# EAGLE board MainECU rev7 (EAGLE 9.2.2), part 1 of 2
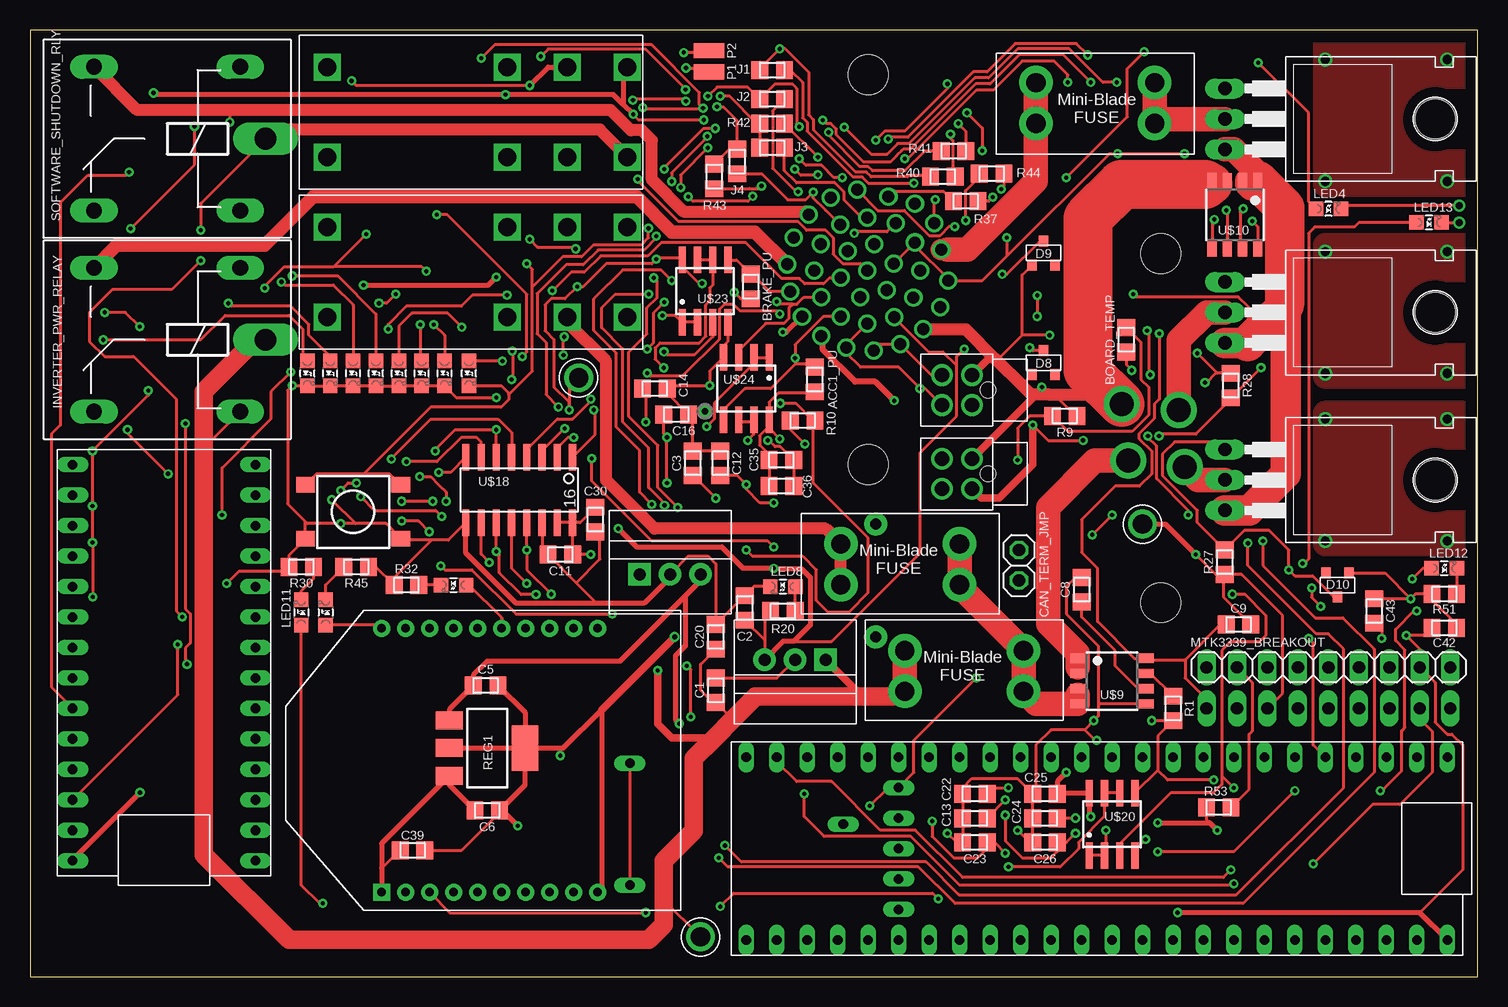
[diagram p2: board, top side]
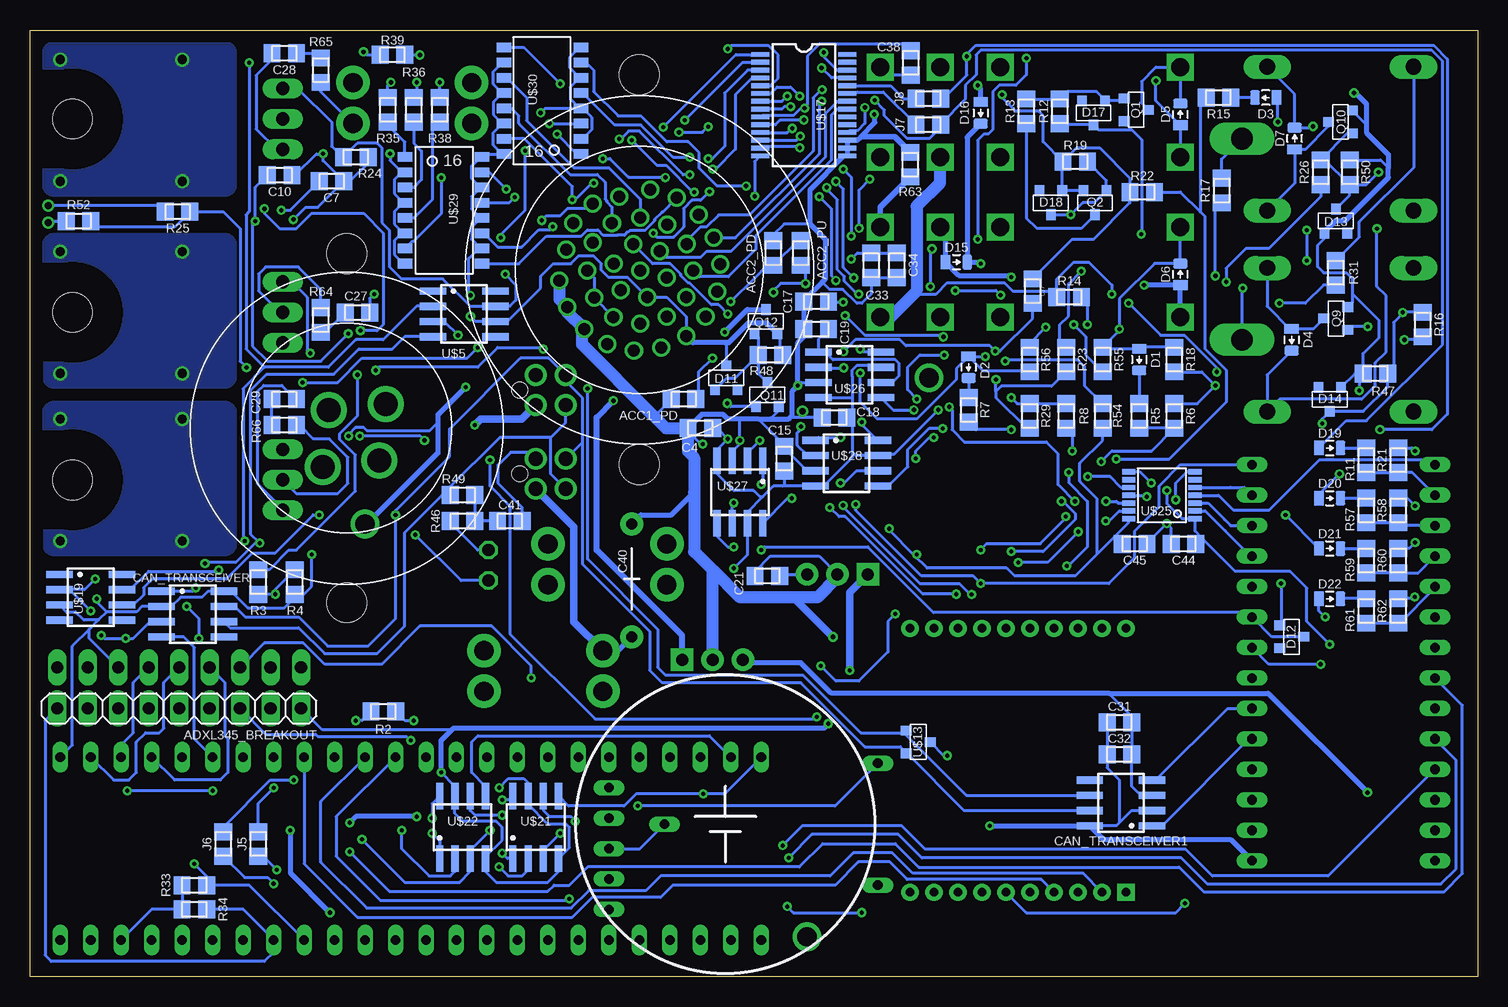
[diagram p3: board, bottom side, seen from below]

Size 120.63 x 78.92 mm. Coordinates in mm from the lower left corner, seen from the top.
Outline: 0,0 120.63,0 120.63,78.92 0,78.92 0,0
Copper layers (1*16): Top 0.035mm / dielectric 1.5mm / Bottom 0.035mm
Design rules "DRC Advanced Circuits": minimum track width 6mil, minimum drill 10mil, track to track 6mil, track to pad 6mil, pad to pad 6mil, via to via 6mil, smd to smd 6mil, copper to edge 40mil, drill to drill 6mil, minimum pad ring 10mil, minimum via ring 8mil, stop-mask expansion 4mil, vias tented up to drill 0mil, thermal gap 10mil

## Footprints (pad centres in the part's own frame; a part is rotated, then mirrored left to right if it is on the bottom)
MINI-BLADE_FUSE_HOLDER = drill 1.613 pad 2.794: L1 0,3.404; L2 0,0; R1 9.906,3.404; R2 9.906,0
0805 = smd 1.4 x 1.5: 1 -1.025,0; 2 1.025,0
1X09 = drill 1.016 long: 1 -8.89,0; 2 -6.35,0; 3 -3.81,0; 4 -1.27,0; 5 1.27,0; 6 3.81,0; 7 6.35,0; 8 8.89,0; 9 11.43,0
RELAY_DPDT = drill 1.5 square: 2 10.008,0; 3 5.004,0; 4 0,0; 5 0,7.493; 6 5.004,7.493; 7 10.008,7.493; COIL+ 25.019,0; COIL- 25.019,7.493
CAP-PTH-LARGE = drill 0.9 pad 1.905: 1 -4.826,0; 2 4.572,0
1X02_SLIM = drill 1.016 octagon: 1 -1.27,0; 2 1.27,0
SOIC-08 = smd 0.6 x 2.2: 1 -1.905,-2.6; 2 -0.635,-2.6; 3 0.635,-2.6; 4 1.905,-2.6; 5 1.905,2.6; 6 0.635,2.6; 7 -0.635,2.6; 8 -1.905,2.6
0805_D = smd 0.8 x 1.2: A -0.9,0; C 0.9,0
SOT23 = smd 0.8 x 0.9: 1 -0.95,-1; 2 0.95,-1; 3 0,1
ZF112 = drill 1.321 long: 1 4.064,14.884; 2 4.064,2.896; O 16.256,14.884; S 16.256,2.896 | drill 1.803 long: P 1.956,8.89
LED-805 = smd 1.2 x 1.2: A 0,-1.05; C 0,1.05
SOLDER_PAD_XSMALL = smd 2.54 x 1.27: P$1 0,0
OKI-78SR = drill 1 pad 1.88 square: 1 -2.54,0 | drill 1 pad 1.88: 2 0,0; 3 2.54,0
SOT223 = smd 1.5 x 2.235: 1 -2.3,-3.15; 2 0,-3.15; 3 2.3,-3.15 | smd 3.8 x 2.2: 4 0,3.15
TACTILE_SWITCH_SMD_6.2MM_TALL = smd 1.55 x 1.3: A1 -3.975,-2.25; A2 3.975,-2.25; B1 -3.975,2.25; B2 3.975,2.25
TEENSY_3.2_SIMPLE = drill 0.8 long: 3.3V 16.51,29.21; A0 16.51,3.81; A1 16.51,6.35; A2 16.51,8.89; A3 16.51,11.43; A4 16.51,13.97; A5 16.51,16.51; A6 16.51,19.05; A7 16.51,21.59; A8 16.51,24.13; A9 16.51,26.67; AGND 16.51,31.75; D0(RX1) 1.27,31.75; D1(TX1) 1.27,29.21; D2 1.27,26.67; D3(CANTX) 1.27,24.13; D4(CANRX) 1.27,21.59; D5 1.27,19.05; D6 1.27,16.51; D7(RX3) 1.27,13.97; D8(TX3) 1.27,11.43; D9(RX2) 1.27,8.89; D10(TX2) 1.27,6.35; D11 1.27,3.81; D12 1.27,1.27; D13 16.51,1.27; GND 1.27,34.29; VIN 16.51,34.29
TEENSY_3.5_EXT = drill 0.8 long: 3.3V 16.51,54.61; 3.3V_1 1.27,24.13; 3.3V_2 6.35,13.97; A0 16.51,29.21; A1 16.51,31.75; A2 16.51,34.29; A3 16.51,36.83; A4 16.51,39.37; A5 16.51,41.91; A6 16.51,44.45; A7 16.51,46.99; A8 16.51,49.53; A9 16.51,52.07; A12 1.27,3.81; A13 1.27,1.27; A14 16.51,1.27; A15 16.51,3.81; A16 16.51,6.35; A17 16.51,8.89; A18 16.51,11.43; A19 16.51,13.97; A20 16.51,16.51; A21 16.51,19.05; A22 16.51,21.59; AGND 16.51,57.15; D0(RX1) 1.27,57.15; D1(TX1) 1.27,54.61; D2 1.27,52.07; D3(CANTX) 1.27,49.53; D4(CANRX) 1.27,46.99; D5 1.27,44.45; D6 1.27,41.91; D7(RX3) 1.27,39.37; D8(TX3) 1.27,36.83; D9(RX2) 1.27,34.29; D10(TX2) 1.27,31.75; D11 1.27,29.21; D12 1.27,26.67; D13 16.51,26.67; D24 1.27,21.59; D25 1.27,19.05; D26 1.27,16.51; D27 1.27,13.97; D28 1.27,11.43; D29 1.27,8.89; D30 1.27,6.35; GND 1.27,59.69; GND_1 16.51,24.13; GND_2 8.89,13.97; PROG 11.43,13.97; RST 13.97,13.97; VBAT 3.81,13.97; VIN 16.51,59.69
XBEE = drill 0.7 pad 1.422 square: 1 -11,5.5 | drill 0.7 pad 1.422: 2 -11,3.5; 3 -11,1.5; 4 -11,-0.5; 5 -11,-2.5; 6 -11,-4.5; 7 -11,-6.5; 8 -11,-8.5; 9 -11,-10.5; 10 -11,-12.5; 11 11,-12.5; 12 11,-10.5; 13 11,-8.5; 14 11,-6.5; 15 11,-4.5; 16 11,-2.5; 17 11,-0.5; 18 11,1.5; 19 11,3.5; 20 11,5.5
TO-220-H-HOLE = drill 1.118 long: 1 -2.54,-6.35; 2 0,-6.35; 3 2.54,-6.35 | hole 3.302: 0,11.176
TEST_POINT = drill 1.6: P$1 0,0
SOP8 = smd 0.76 x 1.27: 1 -1.905,-2.86; 2 -0.635,-2.86; 3 0.635,-2.86; 4 1.905,-2.86; 5 1.905,2.86; 6 0.635,2.86; 7 -0.635,2.86; 8 -1.905,2.86
CR-2450/G1AN = drill 0.8 long: +_0 -5.08,12.7; +_1 5.08,12.7; - 0,-5.08
SSOP28 = smd 0.4 x 1.5: 1 -4.225,-3.625; 2 -3.575,-3.625; 3 -2.925,-3.625; 4 -2.275,-3.625; 5 -1.625,-3.625; 6 -0.975,-3.625; 7 -0.325,-3.625; 8 0.325,-3.625; 9 0.975,-3.625; 10 1.625,-3.625; 11 2.275,-3.625; 12 2.925,-3.625; 13 3.575,-3.625; 14 4.225,-3.625; 15 4.225,3.625; 16 3.575,3.625; 17 2.925,3.625; 18 2.275,3.625; 19 1.625,3.625; 20 0.975,3.625; 21 0.325,3.625; 22 -0.325,3.625; 23 -0.975,3.625; 24 -1.625,3.625; 25 -2.275,3.625; 26 -2.925,3.625; 27 -3.575,3.625; 28 -4.225,3.625
SOIC-16 = smd 0.6 x 2.2: 1 -4.445,-2.794; 2 -3.175,-2.794; 3 -1.905,-2.794; 4 -0.635,-2.794; 5 0.635,-2.794; 6 1.905,-2.794; 7 3.175,-2.794; 8 4.445,-2.794; 9 4.445,2.667; 10 3.175,2.667; 11 1.905,2.667; 12 0.635,2.667; 13 -0.635,2.667; 14 -1.905,2.667; 15 -3.175,2.667; 16 -4.445,2.667
TSSOP-14 = smd 0.45 x 1.1: 1 -1.958,-2.618; 2 -1.308,-2.618; 3 -0.657,-2.618; 4 -0.007,-2.618; 5 0.642,-2.618; 6 1.292,-2.618; 7 1.942,-2.618; 8 1.942,2.918; 9 1.292,2.918; 10 0.642,2.918; 11 -0.007,2.918; 12 -0.657,2.918; 13 -1.308,2.918; 14 -1.958,2.918
11-11F1 = smd 0.8 x 1.2: 1 -4.445,-3.277; 2 -3.175,-3.277; 3 -1.905,-3.277; 4 -0.635,-3.277; 5 0.635,-3.277; 6 1.905,-3.277; 7 3.175,-3.277; 8 4.445,-3.277; 9 4.445,3.15; 10 3.175,3.15; 11 1.905,3.15; 12 0.635,3.15; 13 -0.635,3.15; 14 -1.905,3.15; 15 -3.175,3.15; 16 -4.445,3.15
AUTOSPORT_14-35 = drill 1: P$1 1.143,6.655; P$2 3.124,5.512; P$3 5.359,4.064; P$4 6.452,2.032; P$5 6.756,-0.254; P$6 6.274,-2.489; P$7 5.08,-4.445; P$8 3.302,-5.893; P$9 1.143,-6.655; P$10 -1.143,-6.655; P$11 -3.302,-5.893; P$12 -5.08,-4.445; P$13 -6.274,-2.489; P$14 -6.756,-0.254; P$15 -6.452,2.032; P$16 -5.359,4.064; P$17 -3.124,5.512; P$18 -1.143,6.655; P$19 1.143,4.369; P$20 3.124,3.023; P$21 4.318,1.016; P$22 4.318,-1.27; P$23 3.124,-3.226; P$24 1.143,-4.369; P$25 -1.143,-4.369; P$26 -3.124,-3.226; P$27 -4.318,-1.27; P$28 -4.318,1.016; P$29 -3.124,3.023; P$30 -1.143,4.369; P$31 1.143,1.88; P$32 2.286,-0.102; P$33 1.143,-2.083; P$34 -1.143,-2.083; P$35 -2.286,-0.102; P$36 -1.143,1.88; P$37 0,-0.102 | hole 3.3: -11.491,-11.491; 11.491,11.491
AUTOSPORT_12-04 = drill 2: P$1 0,3.81; P$2 3.708,0.889; P$3 0,-2.108; P$4 -3.708,0.889 | hole 3.3: -10.288,-10.288; 10.288,10.288
NANO-FIT_VERTICAL-4 = drill 1.2: P$1 -1.25,0; P$2 1.25,0; P$3 -1.25,2.5; P$4 1.25,2.5 | hole 1.3: 0,-1.34

## Placement (x,y rotation side)
5ABOARDFUSE  [MINI-BLADE_FUSE_HOLDER]  82.8,27.18 180 top
5AFUSE  [MINI-BLADE_FUSE_HOLDER]  83.82,71.12 0 top
5ASHUTDOWNFUSE  [MINI-BLADE_FUSE_HOLDER]  77.47,36.07 180 top
ACC1_PD  10k  [0805]  66.17,48.13 180 bottom
ACC1_PU  10k  [0805]  65.41,49.78 270 top
ACC2_PD  10k  [0805]  58.67,60.33 90 bottom
ACC2_PU  10k  [0805]  56.39,60.33 270 bottom
ADXL345_BREAKOUT  [1X09]  106.93,22.35 180 bottom
BMS_SHUTDOWN_RLY  RT424012  [RELAY_DPDT]  49.78,75.82 180 top
BOARD_TEMP  THERMISTOR_NCP210805  [0805]  91.36,53.09 90 top
BRAKE_PU  10k  [0805]  60.07,57.53 270 top
C1  10uF  [0805]  57.15,23.88 270 top
C2  10uF  [0805]  59.56,30.73 270 top
C3  47nF  [0805]  55.24,42.8 90 top
C4  .1uF  [0805]  64.77,45.72 180 bottom
C5  1uF  [0805]  37.97,24.26 0 top
C6  1uF  [0805]  38.1,13.84 180 top
C7  47nF  [0805]  95.5,66.29 0 bottom
C8  47nF  [0805]  87.63,32.26 90 top
C9  0.1uF  [0805]  100.71,29.34 0 top
C10  0.1uF  [0805]  99.82,66.8 0 bottom
C11  1uF  [0805]  44.2,35.18 0 top
C12  .1uF  [0805]  57.53,42.8 270 top
C13  470pF  [0805]  78.74,13.21 180 top
C14  47nF  [0805]  52.07,49.02 0 top
C15  .1uF  [0805]  57.78,43.18 90 bottom
C16  .1uF  [0805]  53.85,46.86 180 top
C17  47nF  [0805]  55.12,56.26 180 bottom
C18  .1uF  [0805]  53.59,46.61 180 bottom
C19  .1uF  [0805]  55.12,53.98 0 bottom
C20  10uF  [0805]  57.15,28.32 270 top
C21  10uF  [0805]  59.18,33.4 0 bottom
C22  .1uF  [0805]  78.74,15.24 180 top
C23  .1uF  [0805]  78.74,11.18 0 top
C24  470pF  [0805]  84.58,13.21 180 top
C25  .1uF  [0805]  84.58,15.24 180 top
C26  .1uF  [0805]  84.58,11.18 0 top
C27  [0805]  93.34,55.37 0 bottom
C28  [0805]  99.44,76.96 180 bottom
C29  [0805]  99.44,48.13 0 bottom
C30  0.1uF  [0805]  47.12,38.1 90 top
C31  1uF  [0805]  29.84,21.21 0 bottom
C32  .1uF  [0805]  29.84,18.54 0 bottom
C33  1uF  [0805]  50.55,59.31 90 bottom
C34  .1uF  [0805]  48.39,59.31 90 bottom
C35  1uF  [0805]  62.61,43.05 0 top
C36  .1uF  [0805]  62.61,40.89 0 top
C37  1uF  [0805]  37.08,57.15 270 bottom
C38  0.1uF  [0805]  47.24,76.17 270 bottom
C39  0.1uF  [0805]  31.88,10.54 0 top
C40  470uF  [CAP-PTH-LARGE]  70.48,33.15 90 bottom
C41  4.7nF  [0805]  80.64,37.97 0 bottom
C42  1uF  [0805]  117.86,29.08 180 top
C43  .1uF  [0805]  112.01,30.48 270 top
C44  .1uF  [0805]  24.51,36.07 180 bottom
C45  .1uF  [0805]  28.57,36.07 0 bottom
CAN_TERM_JMP  M02_SLIM  [1X02_SLIM]  82.42,34.29 90 top
CAN_TRANSCEIVER  MCP2551  [SOIC-08]  107.06,30.23 270 bottom
CAN_TRANSCEIVER1  MCP2551  [SOIC-08]  29.72,14.48 90 bottom
D1  TS4148 RYG  [0805_D]  28.19,51.44 270 bottom
D2  TS4148 RYG  [0805_D]  42.42,50.8 270 bottom
D3  TS4148 RYG  [0805_D]  17.65,73.28 180 bottom
D4  TS4148 RYG  [0805_D]  15.49,53.09 270 bottom
D5  TS4148 RYG  [0805_D]  24.77,71.88 90 bottom
D6  TS4148 RYG  [0805_D]  24.77,58.55 90 bottom
D7  TS4148 RYG  [0805_D]  15.24,69.88 90 bottom
D8  MMBZ5246BLT1G  [SOT23]  84.45,51.18 0 top
D9  MMBZ5246BLT1G  [SOT23]  84.45,60.33 0 top
D10  MMBZ5246BLT1G  [SOT23]  108.97,32.64 180 top
D11  MMBZ5246BLT1G  [SOT23]  62.61,49.91 0 bottom
D12  MMBZ5246BLT1G  [SOT23]  15.49,28.32 270 bottom
D13  MMBZ5246BLT1G  [SOT23]  11.81,62.99 0 bottom
D14  MMBZ5246BLT1G  [SOT23]  12.32,48.13 180 bottom
D15  TS4148 RYG  [0805_D]  43.43,59.56 0 bottom
D16  TS4148 RYG  [0805_D]  41.4,72.01 270 bottom
D17  MMBZ5246BLT1G  [SOT23]  32,72.01 180 bottom
D18  MMBZ5246BLT1G  [SOT23]  35.56,64.52 180 bottom
D19  TS4148 RYG  [0805_D]  12.32,44.07 0 bottom
D20  TS4148 RYG  [0805_D]  12.32,39.88 0 bottom
D21  TS4148 RYG  [0805_D]  12.32,35.69 0 bottom
D22  TS4148 RYG  [0805_D]  12.32,31.5 0 bottom
IMD_SHUTDOWN_RLY  RT424009  [RELAY_DPDT]  49.78,62.48 180 top
INVERTER_PWR_RELAY  G5LE  [ZF112]  21.59,61.98 180 top
J1  JUMPER  [0805]  61.85,75.56 180 top
J2  JUMPER  [0805]  61.85,73.15 180 top
J3  JUMPER  [0805]  61.85,69.09 180 top
J4  JUMPER  [0805]  58.93,67.94 90 top
J5  JUMPER  [0805]  101.6,11.05 90 bottom
J6  JUMPER  [0805]  104.52,11.05 90 bottom
J7  JUMPER  [0805]  45.77,71.02 180 bottom
J8  JUMPER  [0805]  45.77,73.2 180 bottom
LED1  White  [LED-805]  36.58,50.29 180 top
LED3  Green  [LED-805]  30.73,50.29 180 top
LED4  Red  [LED-805]  108.2,64.01 270 top
LED5  Yellow  [LED-805]  32.64,50.29 180 top
LED6  Red  [LED-805]  23.11,50.29 180 top
LED7  Green  [LED-805]  28.83,50.29 180 top
LED8  Purple  [LED-805]  62.74,32.51 90 top
LED9  Yellow  [LED-805]  34.54,50.29 180 top
LED10  Red  [LED-805]  35.31,32.64 90 top
LED11  Green  [LED-805]  22.61,30.35 0 top
LED12  Red  [LED-805]  117.86,34.04 270 top
LED13  Red  [LED-805]  116.59,62.87 270 top
LED14  Blue  [LED-805]  24.64,30.35 0 top
LED17  Red  [LED-805]  26.92,50.29 180 top
LED18  Red  [LED-805]  25.02,50.29 180 top
MTK3339_BREAKOUT  [1X09]  106.93,25.78 0 top
P1  SOLDER_PAD  [SOLDER_PAD_XSMALL]  56.57,75.41 0 top
P2  SOLDER_PAD  [SOLDER_PAD_XSMALL]  56.57,77.19 0 top
Q1  P-CHANNEL_MOSFET_DMP3099L-7  [SOT23]  28.45,72.26 270 bottom
Q2  [SOT23]  31.88,64.52 180 bottom
Q9  [SOT23]  11.81,54.86 90 bottom
Q10  [SOT23]  11.43,71.25 90 bottom
Q11  [SOT23]  59.18,48.51 0 bottom
Q12  P-CHANNEL_MOSFET_DMP3099L-7  [SOT23]  59.31,54.61 0 bottom
R1  1K  [0805]  95.25,22.35 270 top
R2  2K  [0805]  91.19,22.1 180 bottom
R3  1K  [0805]  101.6,32.89 270 bottom
R4  2K  [0805]  98.55,32.89 90 bottom
R5  43k  [0805]  28.19,46.74 270 bottom
R6  12k  [0805]  25.27,46.74 90 bottom
R7  43k  [0805]  42.42,47.24 270 bottom
R8  12k  [0805]  34.29,46.74 90 bottom
R9  10k  [0805]  86.23,46.74 180 top
R10  10k  [0805]  64.39,46.35 0 top
R11  43k  [0805]  9.27,43.05 270 bottom
R12  10k  [0805]  34.8,72.14 90 bottom
R13  1k  [0805]  37.59,72.14 90 bottom
R14  2k  [0805]  34.04,56.64 0 bottom
R15  43k  [0805]  21.59,73.28 180 bottom
R16  1.2k  [0805]  4.57,54.36 270 bottom
R17  20k  [0805]  21.34,65.53 270 bottom
R18  2k  [0805]  25.27,51.44 270 bottom
R19  10k  [0805]  33.53,67.94 180 bottom
R20  270  [0805]  62.74,30.48 0 top
R21  12k  [0805]  6.6,43.05 90 bottom
R22  12k  [0805]  27.94,65.41 180 bottom
R23  43k  [0805]  34.29,51.44 270 bottom
R24  10k  [0805]  93.47,68.33 180 bottom
R25  1.2k  [0805]  108.33,63.75 0 bottom
R26  1.2K  [0805]  13.08,67.06 270 bottom
R27  10k  [0805]  99.57,34.54 90 top
R28  10k  [0805]  100.08,49.28 90 top
R29  12k  [0805]  37.34,46.74 90 bottom
R30  33  [0805]  22.61,34.16 0 top
R31  6.8k  [0805]  11.81,58.67 270 bottom
R32  1.2k  [0805]  31.37,32.64 0 top
R33  4.7k  [0805]  106.93,7.62 180 bottom
R34  4.7k  [0805]  106.93,5.59 180 bottom
R35  150  [0805]  90.81,72.26 270 bottom
R36  150  [0805]  88.65,72.26 270 bottom
R37  0  [0805]  77.98,64.64 180 top
R38  150  [0805]  86.49,72.26 270 bottom
R39  150  [0805]  90.42,76.83 180 bottom
R40  150  [0805]  76.07,66.67 0 top
R41  150  [0805]  76.96,68.83 0 top
R42  150  [0805]  61.85,71.12 0 top
R43  150  [0805]  57.02,66.7 270 top
R44  0  [0805]  80.14,66.93 180 top
R45  0  [0805]  27.18,34.16 180 top
R46  60  [0805]  84.58,37.97 180 bottom
R47  10k  [0805]  8.51,50.29 180 bottom
R48  10k  [0805]  58.93,51.82 180 bottom
R49  60  [0805]  84.58,40.13 0 bottom
R50  10k  [0805]  10.67,67.06 90 bottom
R51  1.2k  [0805]  117.86,31.88 180 top
R52  1.2k  [0805]  116.59,62.99 0 bottom
R53  10k  [0805]  99.06,14.1 0 top
R54  5.1k  [0805]  31.24,46.74 90 bottom
R55  2k  [0805]  31.24,51.44 270 bottom
R56  33  [0805]  37.34,51.44 90 bottom
R57  43k  [0805]  9.27,38.86 270 bottom
R58  12k  [0805]  6.6,38.86 90 bottom
R59  43k  [0805]  9.27,34.67 270 bottom
R60  12k  [0805]  6.6,34.67 90 bottom
R61  43k  [0805]  9.27,30.48 270 bottom
R62  12k  [0805]  6.6,30.48 90 bottom
R63  20  [0805]  47.27,67.69 90 bottom
R64  [0805]  96.39,54.74 270 bottom
R65  [0805]  96.39,75.56 90 bottom
R66  [0805]  99.44,45.97 180 bottom
REG  5V  [OKI-78SR]  63.75,26.42 180 top
REG1  LM3940  [SOT223]  38.1,19.05 270 top
REG3  5V  [OKI-78SR]  53.34,33.53 0 top
S1  [TACTILE_SWITCH_SMD_6.2MM_TALL]  26.92,38.73 180 top
SOFTWARE_SHUTDOWN_RLY  G5LE  [ZF112]  21.59,78.74 180 top
U$1  TEENSY_3.2_SIMPLE  [TEENSY_3.2_SIMPLE]  20.07,43.94 180 top
U$2  TEENSY_3.5_EXT  [TEENSY_3.5_EXT]  58.42,19.56 270 top
U$3  XBEE  [XBEE]  34.8,18.03 90 top
U$4  N-CHANNEL_MOSFET_IRF1324PBF  [TO-220-H-HOLE]  105.92,55.37 270 top
U$5  MC34152  [SOIC-08]  84.45,55.24 270 bottom
U$6  N-CHANNEL_MOSFET_IRF1324PBF  [TO-220-H-HOLE]  105.92,41.4 270 top
U$7  N-CHANNEL_MOSFET_IRF1324PBF  [TO-220-H-HOLE]  105.92,71.5 270 top
U$8  TEST_POINT  [TEST_POINT]  55.88,3.3 0 top
U$9  ACS715_CURRENT_SENSOR  [SOP8]  90.17,24.64 270 top
U$10  ACS715_CURRENT_SENSOR  [SOP8]  100.41,63.5 180 top
U$11  TEST_POINT  [TEST_POINT]  45.72,49.91 0 top
U$12  TEST_POINT  [TEST_POINT]  92.71,37.72 0 top
U$13  CDSOT23-T24CAN-Q  [SOT23]  46.61,19.56 270 bottom
U$16  CR-2450/G1AN  [CR-2450/G1AN]  62.69,12.7 270 bottom
U$17  MCP23S17SSOP28  [SSOP28]  56.13,72.64 270 bottom
U$18  MCP3208SOIC  [SOIC-16]  40.77,40.51 180 top
U$19  MC34152  [SOIC-08]  115.57,31.62 270 bottom
U$20  MCP6002SOIC  [SOIC-08]  90.17,12.7 0 top
U$21  [SOIC-08]  78.49,12.45 0 bottom
U$22  [SOIC-08]  84.58,12.45 0 bottom
U$23  MCP6002SOIC  [SOIC-08]  56.26,57.15 0 top
U$24  MCP6002SOIC  [SOIC-08]  59.69,49.02 180 top
U$25  TXB0104TSSOP  [TSSOP-14]  26.16,40.13 90 bottom
U$26  [SOIC-08]  52.32,50.16 270 bottom
U$27  [SOIC-08]  61.47,40.39 180 bottom
U$28  [SOIC-08]  52.58,42.8 270 bottom
U$29  TLP291-4  [11-11F1]  86.11,63.88 270 bottom
U$30  TLP291-4  [11-11F1]  77.98,73.03 90 bottom
X1  CONNECTOR-37  [AUTOSPORT_14-35]  69.85,58.93 45 bottom
X2  CONNECTOR-4AUTOSPORT  [AUTOSPORT_12-04]  94.23,45.72 225 bottom
X3  CONNECTOR-4NANO-FIT-VERTICAL-4  [NANO-FIT_VERTICAL-4]  78.49,48.9 90 top
X4  CONNECTOR-4NANO-FIT-VERTICAL-4  [NANO-FIT_VERTICAL-4]  78.49,41.91 90 top